# EasyEDA Pro project ArduinoIO_R1.eprj

# Schematic Schematic1
Create Date: 2022-08-13; Page Name: P1; Project Name: ArduinoIO_R1; Schematic Name: Schematic1; Update Date: 2022-08-13
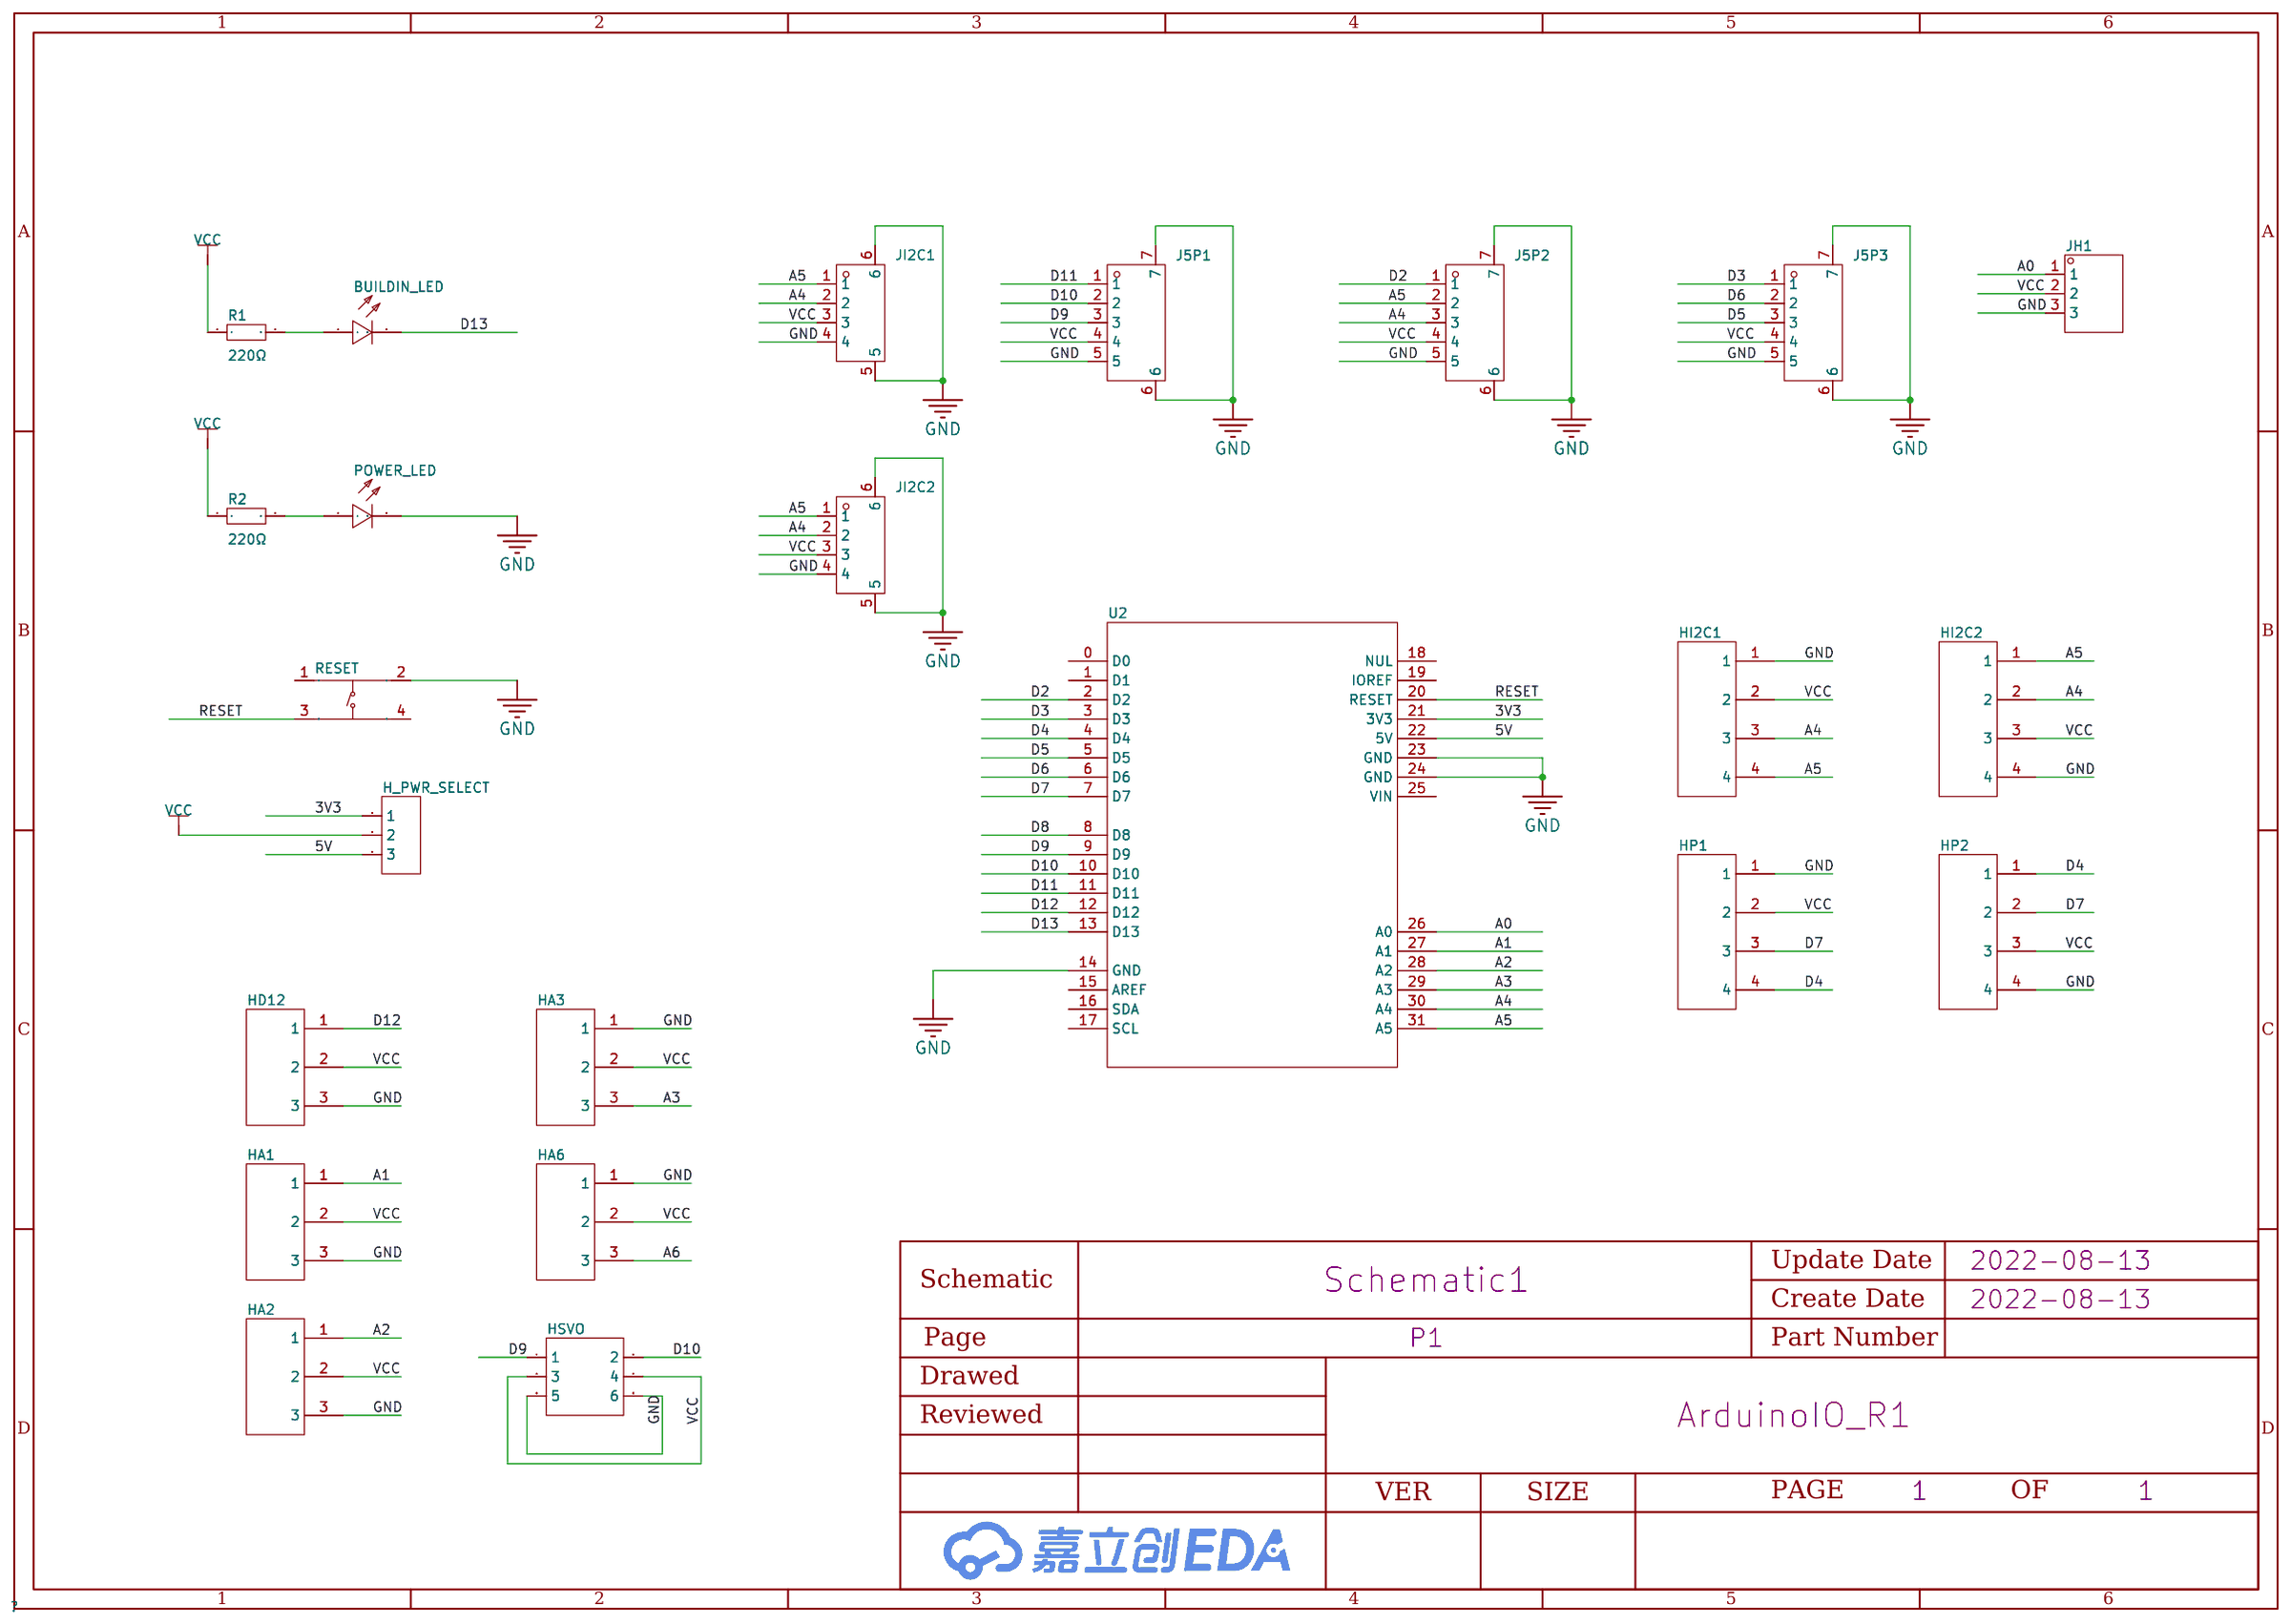
[diagram p0: schematic sheet]

## Parts
BUILDIN_LED  -  [LED0603-R-RD]
H_PWR_SELECT  -  [HDR-TH_3P-P2.54-V-M-1]
HA1  -  [CONN-TH_B3B-PH-K-S]
HA2  -  [CONN-TH_B3B-PH-K-S]
HA3  -  [CONN-TH_B3B-PH-K-S]
HA6  -  [CONN-TH_B3B-PH-K-S]
HD12  -  [CONN-TH_B3B-PH-K-S]
HI2C1  -  [CONN-TH_B4B-PH-K-S]
HI2C2  -  [CONN-TH_B4B-PH-K-S]
HP1  -  [CONN-TH_B4B-PH-K-S]
HP2  -  [CONN-TH_B4B-PH-K-S]
HSVO  -  [HDR-TH_6P-P2.54-V-M-R2-C3-S2.54-1]
J5P1  -  [FPC-SMD_5P-P2.00_DEALON_PH-5PWB]
J5P2  -  [FPC-SMD_5P-P2.00_DEALON_PH-5PWB]
J5P3  -  [FPC-SMD_5P-P2.00_DEALON_PH-5PWB]
JH1  -  [HDR-TH_3P-P2.54-V-M-1]
JI2C1  -  [CONN-SMD_4P-P2.00_HDGC_HDGC2001WR-S-4P]
JI2C2  -  [CONN-SMD_4P-P2.00_HDGC_HDGC2001WR-S-4P]
POWER_LED  -  [LED0603-R-RD]
R1  220Ω  [R0603]
R2  220Ω  [R0603]
RESET  -  [SW-TH_4P-L6.0-W6.0-P4.50-LS6.5]
U2  -  [ARDUINO_UNO_SHEILD]

## Library data of the parts
BUILDIN_LED POWER_LED = 19-217/GHC-YR1S2/3T: 照明颜色:翠绿;色温 - CCT（K）:-;主波长/色坐标:520~535nm;; LCSC Part Name: 翠绿LED; Supplier Part: C72043; Manufacturer: EVERLIGHT(台湾亿光); Supplier Footprint: 0603; JLCPCB Part Class: Basic Part; Datasheet: https://atta.szlcsc.com/upload/public/pdf/source/20160507/1462613613780.pdf; Supplier: LCSC; Mounting Type: 表面贴装; Illumination Color: 翠绿; Luminous Intensity (IF=20mA): 112~258mcd; Dominant Wavelength / Coordinate rank: 520~535nm
H_PWR_SELECT = 2.54-1*3P针: 间距:2.54mm;总PIN位数:3;排数:1;插针结构:1x3P;行距:-;安装类型:直插;圆针/方针:方针;额定电流:3A;额定电压:-;配合针长度:-;塑高:-;端接针长度:-;触头材质:-;触头镀层:-;工作温度范围:-40~+105;颜色:黑色;; LCSC Part Name: 2.54mm 1x3P 直插 方针; Supplier Part: C49257; Manufacturer: BOOMELE(博穆精密); Supplier Footprint: 插件,P=2.54mm; JLCPCB Part Class: Extended Part; Datasheet: https://atta.szlcsc.com/upload/public/pdf/source/20151109/1457707570948.pdf; Supplier: LCSC; Pitch: 2.54mm; Number of Pins: 3; Number of Rows: 1; Pin Structure: 1x3P; Mounting Type: 直插; Circluar Pins/Square Pins: 方针; Current Rating (Max): 3A; Operating Temperature Range: -40~+105; Color: 黑色
HA1-HA3 HA6 HD12 = B3B-PH-K-S(LF)(SN): 参考系列:PH;间距:2mm;插针结构:1x3P;排数:1;每排PIN数:3;行距:-;安装方式:-;触头材质:黄铜;; Supplier Part: C131339; Manufacturer: JST; Supplier Footprint: 插件,P=2mm; JLCPCB Part Class: Extended Part; Datasheet: https://atta.szlcsc.com/upload/public/pdf/source/20171026/C131339_15089839676151058812.pdf; Supplier: LCSC; Reference Series: PH; Pitch: 2mm; Pins Structure: 1x3P; Number of Rows: 1; Number of PINs Per Row: 3; Contact Material: 黄铜
HI2C1 HI2C2 HP1 HP2 = B4B-PH-K-S(LF)(SN): 参考系列:PH;间距:2mm;插针结构:1x4P;排数:1;每排PIN数:4;行距:-;安装方式:-;触头材质:黄铜;; Supplier Part: C131334; Manufacturer: JST; Supplier Footprint: 插件,P=2mm; JLCPCB Part Class: Extended Part; Datasheet: https://atta.szlcsc.com/upload/public/pdf/source/20171026/C131334_15089839666431058809.pdf; Supplier: LCSC; Reference Series: PH; Pitch: 2mm; Pins Structure: 1x4P; Number of Rows: 1; Number of PINs Per Row: 4; Contact Material: 黄铜
HSVO = 2.54-2*3P针: 间距:2.54mm;总PIN位数:6;排数:2;插针结构:-;行距:-;安装类型:直插;圆针/方针:-;额定电流:-;额定电压:-;配合针长度:-;塑高:-;触头材质:-;触头镀层:-;颜色:黑色;; LCSC Part Name: 2.54mm 直插; Supplier Part: C65114; Manufacturer: BOOMELE(博穆精密); Supplier Footprint: 直插,P=2.54mm; JLCPCB Part Class: Extended Part; Datasheet: https://atta.szlcsc.comnull; Supplier: LCSC; Pitch: 2.54mm; Number of Pins: 6; Number of Rows: 2; Mounting Type: 直插; Color: 黑色
J5P1-J5P3 = PH-5PWB: 参考系列:-;间距:2mm;插针结构:1x5P;排数:1;每排PIN数:5;行距:-;公母:公型插针;安装方式:卧贴;额定电流:2A;工作温度范围:-25~+85;; LCSC Part Name: 2mm 1x5P 卧贴; Supplier Part: C2905022; Manufacturer: DEALON(德艺隆); Supplier Footprint: SMD,P=2mm; JLCPCB Part Class: Extended Part; Datasheet: https://atta.szlcsc.com/upload/public/pdf/source/20211025/88D30C4184EDA7DDDA5DC9C9FBC20DFC.pdf; Supplier: LCSC; Pitch: 2mm; Pins Structure: 1x5P; Number of Rows: 1; Number of PINs Per Row: 5; Gender: 公型插针; Mounting Style: 卧贴; Current Rating (Max): 2A; Operating Temperature Range: -25~+85
JH1 = 77311-102-03LF: 间距:2.54mm;总PIN位数:-;排数:1;插针结构:-;行距:-;安装类型:直插;圆针/方针:方针;额定电流:-;额定电压:-;配合针长度:-;塑高:2.54mm;触头材质:磷青铜;触头镀层:-;颜色:黑色;; LCSC Part Name: 2.54mm 直插 方针; Supplier Part: C180248; Manufacturer: Amphenol; Supplier Footprint: 直插,P=2.54mm; JLCPCB Part Class: Extended Part; Datasheet: https://atta.szlcsc.com/upload/public/pdf/source/20180329/C180248_62E264527695F7ED58561BB828D45E42.pdf; Supplier: LCSC; Pitch: 2.54mm; Number of Rows: 1; Mounting Type: 直插; Circluar Pins/Square Pins: 方针; Insulation Height: 2.54mm; Contact Material: 磷青铜; Color: 黑色
JI2C1 JI2C2 = HDGC2001WR-S-4P: 参考系列:PH;间距:2mm;插针结构:1x4P;排数:1;每排PIN数:4;行距:-;公母:公型插针;安装方式:卧贴;额定电流:5A;工作温度范围:-25~+70;; LCSC Part Name: PH2.0针座卧贴 4P; Supplier Part: C2936226; Manufacturer: HDGC(华德共创); Supplier Footprint: SMD,P=2mm; JLCPCB Part Class: Extended Part; Datasheet: https://atta.szlcsc.com/upload/public/pdf/source/20211224/97C496F606ECD8881F21462B7EF9EC10.pdf; Supplier: LCSC; Reference Series: PH; Pitch: 2mm; Pins Structure: 1x4P; Number of Rows: 1; Number of PINs Per Row: 4; Gender: 公型插针; Mounting Style: 卧贴; Current Rating (Max): 5A; Operating Temperature Range: -25~+70
R1 R2 = TR0603B10K0P0525Z: 阻值:10kΩ;精度:±0.1%;温度系数:±25ppm/;功率:100mW;工作温度范围:-55~+155;电阻类型:薄膜电阻;最大工作电压:75V;; LCSC Part Name: 10kΩ ±0.1%; Supplier Part: C188363; Manufacturer: EVER OHMS(天二科技); Supplier Footprint: 0603; JLCPCB Part Class: Extended Part; Datasheet: https://atta.szlcsc.com/upload/public/pdf/source/20190415/C188363_433BF05B6FB8F7A0F5F35A3E4390C55A.pdf; Supplier: LCSC; Tolerance: ±0.1%; Temperature Coefficient: ±25ppm/; Power(Watts): 100mW; Operating Temperature Range: -55~+155; Type: 薄膜电阻; Overload Voltage (Max): 75V
RESET = TS665CJ: 触点电流:50mA;额定电压(DC):12V;电路结构:单刀单掷;安装方式:直插;按钮形状:圆形按钮;带灯:-;开关长度:6mm;开关宽度:6mm;开关高度:5mm;; LCSC Part Name: 6*6*5插件立式直插6x6dip按键轻触开关; Supplier Part: C393938; Manufacturer: SHOU HAN(首韩); Supplier Footprint: 插件; JLCPCB Part Class: Extended Part; Datasheet: https://atta.szlcsc.com/upload/public/pdf/source/20190521/C393938_BDABEAC600B4C55E200A80AA129B70BC.pdf; Supplier: LCSC; Contact Current: 50mA; Voltage Rating (DC): 12V; Circuit: 单刀单掷; Mounting Style: 直插; Actuator Style: 圆形按钮; Switch Length: 6mm; Switch Width: 6mm; Switch Height: 5mm
U2 = arduino_uno

## Nets
3V3: H_PWR_SELECT.1 U2.21(3V3)
5V: H_PWR_SELECT.3 U2.22(5V)
GND: HA1.3 HA2.3 HA3.1 HA6.1 HD12.3 HI2C1.1 HI2C2.4 HP1.1 HP2.4 HSVO.5 HSVO.6 J5P1.5 J5P1.6 J5P1.7 J5P2.5 J5P2.6 J5P2.7 J5P3.5 J5P3.6 J5P3.7 JH1.3 JI2C1.4 JI2C1.5 JI2C1.6 JI2C2.4 JI2C2.5 JI2C2.6 POWER_LED.2(C) RESET.2(B) U2.14(GND) U2.23(GND) U2.24(GND)
VCC: H_PWR_SELECT.2 HA1.2 HA2.2 HA3.2 HA6.2 HD12.2 HI2C1.2 HI2C2.3 HP1.2 HP2.3 HSVO.3 HSVO.4 J5P1.4 J5P2.4 J5P3.4 JH1.2 JI2C1.3 JI2C2.3 R1.1 R2.1
A0: JH1.1 U2.26(A0)
A1: HA1.1 U2.27(A1)
A2: HA2.1 U2.28(A2)
A3: HA3.3 U2.29(A3)
A4: HI2C1.3 HI2C2.2 J5P2.3 JI2C1.2 JI2C2.2 U2.30(A4)
A5: HI2C1.4 HI2C2.1 J5P2.2 JI2C1.1 JI2C2.1 U2.31(A5)
A6: HA6.3
D2: J5P2.1 U2.2(D2)
D3: J5P3.1 U2.3(D3)
D4: HP1.4 HP2.1 U2.4(D4)
D5: J5P3.3 U2.5(D5)
D6: J5P3.2 U2.6(D6)
D7: HP1.3 HP2.2 U2.7(D7)
D8: U2.8(D8)
D9: HSVO.1 J5P1.3 U2.9(D9)
D10: HSVO.2 J5P1.2 U2.10(D10)
D11: J5P1.1 U2.11(D11)
D12: HD12.1 U2.12(D12)
D13: BUILDIN_LED.2(C) U2.13(D13)
RESET: RESET.3(C) U2.20(RESET)
$1N1147: BUILDIN_LED.1(A) R1.2
$1N1725: POWER_LED.1(A) R2.2

Not connected (* = marked no-connect by the designer): RESET 1(A) 4(D); U2 0(D0) 1(D1) 15(AREF) 16(SDA) 17(SCL) 18(NUL) 19(IOREF) 25(VIN)

# Board PCB1
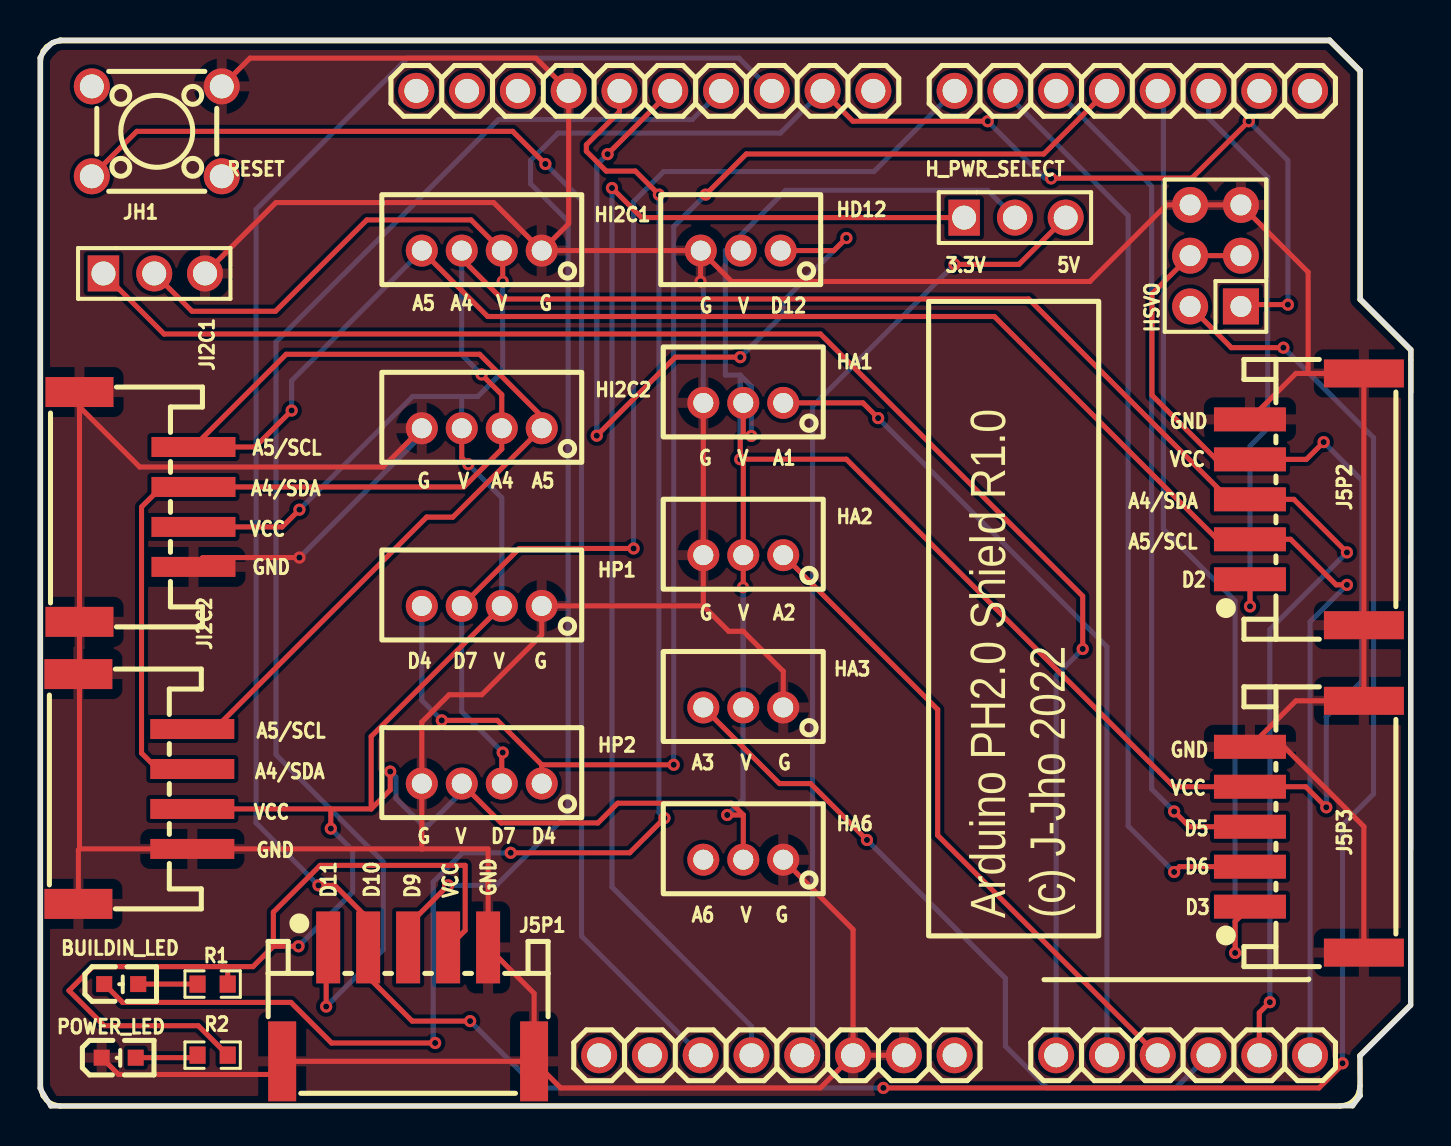
[diagram p1: board, top side]
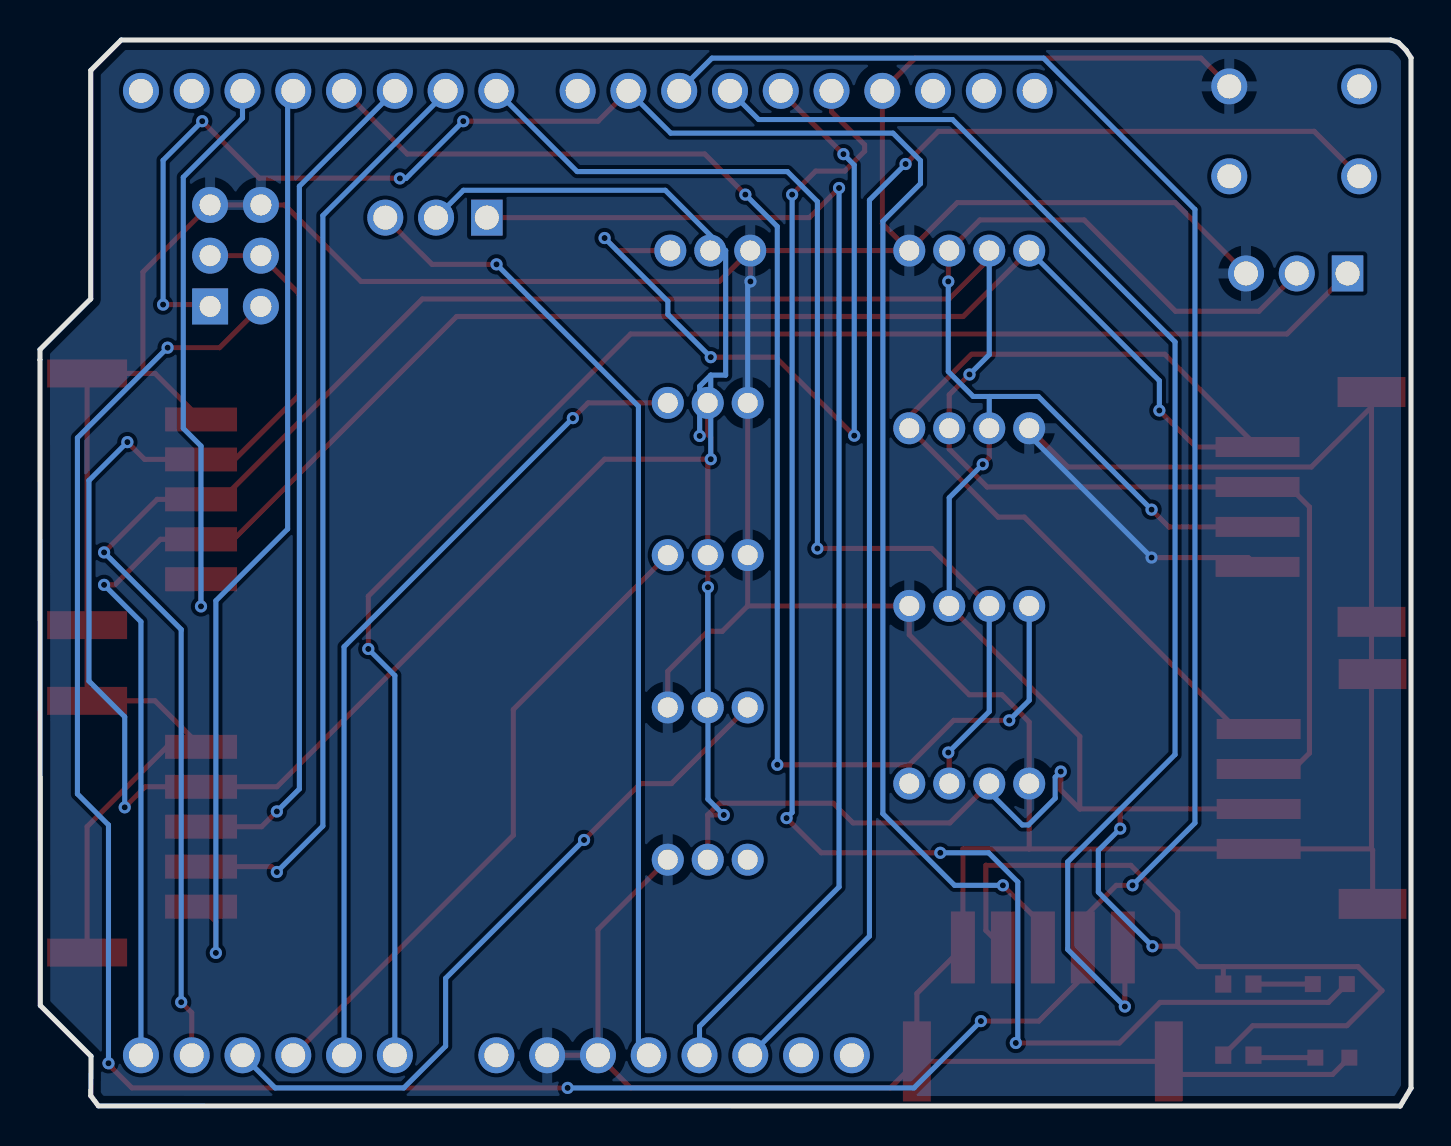
[diagram p2: board, bottom side, seen from below]

Outline 68.58 x 53.35 mm; copper layers: Top Layer, Bottom Layer. Coordinates in mm from the lower left corner of the outline.
Outline path: 0,52.46 0.25,52.84 0.64,53.22 1.02,53.35 64.52,53.35 66.04,51.82 66.04,40.39 68.58,37.85 68.58,37.34 68.56,5.03 66.03,2.49 66.04,0.51 65.66,0.01 0.54,0 0,0.9 0,52.46
Stack: Top Layer 0.035mm / Dielectric1 1.51mm FR4 er 4.5 / Bottom Layer 0.035mm

## Design rules (mm)
spacing safeClearance (default): track to track 0.152, other pairs 0.152 to 0.3
track width trackWidth (default): min 0.127, default 0.254, max 2.54
differential pair differentialPair (default): width min 0.127, default 0.254, max 2.54; gap min 0.152, default 0.152
via viaSize (default): diameter min 0.5, default 0.61, max 10; hole min 0.3, default 0.305, max 6

## Placement (name value [footprint] x y rotation side)
BUILDIN_LED  -  [LED0603-R-RD]  4.06 6.1 0 top
H_PWR_SELECT  -  [HDR-TH_3P-P2.54-V-M-1]  48.77 44.46 0 top
HA1  -  [CONN-TH_B3B-PH-K-S]  35.18 35.19 0 top
HA2  -  [CONN-TH_B3B-PH-K-S]  35.18 27.57 0 top
HA3  -  [CONN-TH_B3B-PH-K-S]  35.18 19.95 0 top
HA6  -  [CONN-TH_B3B-PH-K-S]  35.18 12.33 0 top
HD12  -  [CONN-TH_B3B-PH-K-S]  35.05 42.81 0 top
HI2C1  -  [CONN-TH_B4B-PH-K-S]  22.1 42.81 0 top
HI2C2  -  [CONN-TH_B4B-PH-K-S]  22.1 33.92 0 top
HP1  -  [CONN-TH_B4B-PH-K-S]  22.1 25.03 0 top
HP2  -  [CONN-TH_B4B-PH-K-S]  22.1 16.14 0 top
HSVO  -  [HDR-TH_6P-P2.54-V-M-R2-C3-S2.54-1]  58.8 42.55 90 top
J5P1  -  [FPC-SMD_5P-P2.00_DEALON_PH-5PWB]  18.41 5.09 0 top
J5P2  -  [FPC-SMD_5P-P2.00_DEALON_PH-5PWB]  63.37 30.36 90 top
J5P3  -  [FPC-SMD_5P-P2.00_DEALON_PH-5PWB]  63.37 13.98 90 top
JH1  -  [HDR-TH_3P-P2.54-V-M-1]  5.72 41.66 0 top
JI2C1  -  [CONN-SMD_4P-P2.00_HDGC_HDGC2001WR-S-4P]  4.83 29.98 270 top
JI2C2  -  [CONN-SMD_4P-P2.00_HDGC_HDGC2001WR-S-4P]  4.77 15.87 270 top
POWER_LED  -  [LED0603-R-RD]  3.94 2.42 0 top
R1  220Ω  [R0603]  8.64 6.1 180 top
R2  220Ω  [R0603]  8.64 2.55 180 top
RESET  -  [SW-TH_4P-L6.0-W6.0-P4.50-LS6.5]  5.84 48.77 0 top
U2  -  [ARDUINO_UNO_SHEILD]  0.03 0 0 top

## Footprints (pads in the part's own frame, mm; a bottom-side part is the same pattern mirrored in y, then rotated)
ARDUINO_UNO_SHEILD
  round 1.8 hole 1.2: 0(63.5,50.8) 1(60.96,50.8) 2(58.42,50.8) 3(55.88,50.8) 4(53.34,50.8) 5(50.8,50.8) 6(48.26,50.8) 7(45.72,50.8) 8(41.656,50.8) 9(39.116,50.8) 10(36.576,50.8) 11(34.036,50.8) 12(31.496,50.8) 13(28.956,50.8) 14(26.416,50.8) 15(23.876,50.8) 16(21.336,50.8) 17(18.796,50.8) 18(27.94,2.54) 19(30.48,2.54) 20(33.02,2.54) 21(35.56,2.54) 22(38.1,2.54) 23(40.64,2.54) 24(43.18,2.54) 25(45.72,2.54) 26(50.8,2.54) 27(53.34,2.54) 28(55.88,2.54) 29(58.42,2.54) 30(60.96,2.54) 31(63.5,2.54)
CONN-SMD_4P-P2.00_HDGC_HDGC2001WR-S-4P
  rect 1x4.2 smd: 1(-3,2.85) 2(-1,2.85) 3(1,2.85) 4(3,2.85)
  rect 1.5x3.4 smd: 5(5.75,-2.85) 6(-5.75,-2.85)
CONN-TH_B3B-PH-K-S
  round 1.6 hole 1.001: 1(1.999,0) 2(0,0) 3(-1.999,0)
CONN-TH_B4B-PH-K-S
  round 1.6 hole 1.001: 1(2.999,0) 2(1.001,0) 3(-1.001,0) 4(-2.999,0)
FPC-SMD_5P-P2.00_DEALON_PH-5PWB
  rect 1.2x3.6 smd: 1(-4,2.85) 2(-2,2.85) 3(0,2.85) 4(2,2.85) 5(4,2.85)
  rect 1.4x4 smd: 6(6.3,-2.85) 7(-6.3,-2.85)
HDR-TH_3P-P2.54-V-M-1
  rect 1.575x1.801 hole 1.199: 1(-2.54,0)
  round 1.801 hole 1.199: 2(0,0) 3(2.54,0)
HDR-TH_6P-P2.54-V-M-R2-C3-S2.54-1
  rect 1.801x1.801 hole 1.049: 1(-2.54,-1.27)
  round 1.801 hole 1.049: 2(-2.54,1.27) 3(0,-1.27) 4(0,1.27) 5(2.54,-1.27) 6(2.54,1.27)
LED0603-R-RD
  rect 0.8x0.8 smd: 1(0.851,0) 2(-0.851,0)
R0603
  rect 0.806x0.864 smd: 1(-0.753,0) 2(0.753,0)
SW-TH_4P-L6.0-W6.0-P4.50-LS6.5
  round 1.8 hole 1.2: 1(-3.25,2.25) 2(3.25,2.25) 3(-3.25,-2.25) 4(3.25,-2.25)

## Nets
As in the schematic.

Pads without a net: RESET 1 4; U2 0 1 15 16 17 18 19 25

## Via types
v1: diameter 0.61, hole 0.305, Top Layer to Bottom Layer, 53 vias

## Routing (per net, layer and track width the routed paths; a pad name or vN(x,y) marks a point on that pad's centre or on a via; arc(x,y) is an arc through that point)
3V3: length 64.5
  Top Layer w0.254: v1(28.61,45.94) 30.09,44.46 H_PWR_SELECT.1
  Bottom Layer w0.254: 35.59,2.54 35.59,3.98 28.61,10.96 v1(28.61,45.94)
5V: length 49.3
  Top Layer w0.254: H_PWR_SELECT.3 48.97,42.12 v1(45.74,42.12)
  Bottom Layer w0.254: v1(45.74,42.12) 38.65,35.02 38.65,3.05 38.13,2.54
GND: length 330.1
  Top Layer w0.254: 63.43,36.66 62.82,36.66 J5P2.5 ; 63.43,36.66 J5P2.6 J5P3.6 62.82,20.28 J5P3.5 62.23,17.98 66.22,13.98 J5P3.7 ; 63.43,36.66 63.43,41.73 60.07,45.09 HSVO.6 56.35,45.09 52.52,41.26 34.6,41.26 HD12.3 33.04,42.81 ; 40.67,2.54 40.67,8.83 HA6.1 ; 40.67,2.54 43.21,2.54 ; 40.67,2.54 39.04,0.91 26.05,0.91 J5P1.6 ; 1.98,21.62 JI2C1.5 1.98,34.99 ; 1.98,21.62 JI2C2.6 ; 1.98,21.62 1.98,12.87 ; 19.1,12.87 HP2.4 19.1,19.21 20.46,20.58 22.1,20.58 25.1,23.58 HP1.1 33.18,25.03 ; 19.1,12.87 JI2C2.4 1.98,12.87 ; 19.1,12.87 22.41,12.87 J5P1.5 24.72,5.64 J5P1.6 ; v1(33.04,41.26) 33.04,42.81 ; 33.04,42.81 HI2C1.1 ; HI2C1.1 22.7,45.21 11.8,45.21 JH1.3 ; HI2C1.1 26.45,44.15 U2.14 24.81,52.44 10.51,52.44 RESET.2 ; 1.98,12.87 1.92,12.81 JI2C2.5 ; J5P1.6 J5P1.7 11.46,1.58 3.93,1.58 POWER_LED.2 ; 1.98,34.99 4.98,31.98 17.16,31.98 HI2C2.4 ; 1.98,34.99 JI2C1.6 ; HA1.3 HA2.3 33.18,25.03 ; v1(12.98,27.45) 8.14,27.45 JI2C1.4 ; 33.18,25.03 34.45,23.76 35.18,23.76 37.18,21.76 HA3.1
  Bottom Layer w0.254: v1(12.98,27.45) 19.1,33.57 HI2C2.4 ; v1(33.04,41.26) 33.18,41.12 HA1.3
VCC: length 289.1
  Top Layer w0.254: 35.18,14.56 34.59,15.15 28.9,15.15 27.91,14.17 23.07,14.17 HP2.3 ; 35.18,14.56 HA6.2 ; 35.18,14.56 v1(34.38,14.56) ; 9.39,6.98 10.65,6.98 11.67,7.99 ; 9.39,6.98 R1.1 ; 9.39,6.98 2.65,6.98 1.45,5.78 3.21,4.02 7.92,4.02 R2.1 ; v1(17.52,16.74) 17.52,15.82 16.57,14.87 ; 35.18,32.37 v1(35.03,32.37) 35.03,33.46 35.18,33.61 HA1.2 ; 35.18,32.37 HA2.2 35.18,25.97 v1(35.17,25.96) ; 35.18,32.37 40.34,32.37 56.73,15.98 J5P3.4 63.31,15.98 v1(64.34,14.95) ; v1(21.42,32.11) 21.1,32.44 HI2C2.3 ; 16.57,14.87 16.57,18.49 23.1,25.03 ; 16.57,14.87 14.55,14.87 ; 11.67,7.99 v1(12.93,7.99) ; 11.67,7.99 11.67,9.7 14.02,12.04 21.27,12.04 21.27,8.79 J5P1.4 ; v1(14.55,13.88) 14.55,14.87 ; 14.55,14.87 JI2C2.3 ; v1(12.98,29.84) 12.11,28.98 JI2C1.3 ; JH1.2 7.61,39.77 11.78,39.77 16.35,44.34 21.56,44.34 23.15,42.76 v1(23.15,41.26) ; 60.07,42.55 HSVO.4 55.62,40.65 55.62,35.57 58.83,32.36 63.35,32.36 v1(64.21,33.22)
  Bottom Layer w0.254: HD12.2 34.28,42.81 ; 34.28,42.81 37.3,45.82 47.4,45.82 H_PWR_SELECT.2 ; 34.28,42.81 34.28,36.57 35.03,36.57 ; v1(12.98,29.84) 18.64,35.51 21.1,35.51 ; 35.03,36.57 v1(35.03,32.37) ; 35.03,36.57 35.58,36.02 v1(35.58,33.53) ; v1(23.15,41.26) 23.15,36.75 21.9,35.51 21.1,35.51 ; 21.1,35.51 HI2C2.3 ; v1(14.55,13.88) 15.64,12.79 15.64,10.7 v1(12.93,7.99) ; HA3.2 35.18,25.95 v1(35.17,25.96) 35.17,15.36 v1(34.38,14.56) ; v1(64.34,14.95) 64.34,19.48 66.13,21.27 66.13,31.3 v1(64.21,33.22) ; HP2.3 21.1,15.71 19.45,14.07 19.14,14.07 17.8,15.4 17.8,16.46 v1(17.52,16.74) ; v1(21.42,32.11) 23.1,30.44 23.1,25.03
A0: length 79.2
  Top Layer w0.254: JH1.1 6.21,38.63 39.04,38.63 52.16,25.51 v1(52.16,22.87)
  Bottom Layer w0.254: v1(52.16,22.87) 50.83,21.54 50.83,2.54
A1: length 41.7
  Top Layer w0.254: v1(41.93,34.42) 41.16,35.19 HA1.1
  Bottom Layer w0.254: v1(41.93,34.42) 53.37,22.98 53.37,2.54
A2: length 32.8
  Top Layer w0.254: HA2.1 44.9,19.84 44.9,13.55 55.91,2.54
A3: length 35.8
  Top Layer w0.254: HA3.3 36.99,16.14 38.54,16.14 v1(41.37,13.31)
  Bottom Layer w0.254: 58.45,2.54 56.82,0.91 50.38,0.91 48.29,3 48.29,6.39 v1(41.37,13.31)
A4: length 122.9
  Top Layer w0.254: v1(65.37,27.7) 62.72,30.36 J5P2.3 59.48,30.36 49.46,40.39 23.11,40.39 21.1,42.4 HI2C1.3 ; 60.99,2.54 60.99,4.67 v1(61.52,5.2) ; JI2C2.2 5.87,16.87 5.08,17.66 5.08,29.98 6.08,30.98 21.2,30.98 23.1,32.87 23.1,35.6 v1(22.09,36.61)
  Bottom Layer w0.254: v1(22.09,36.61) 21.1,37.6 HI2C1.3 ; v1(61.52,5.2) 61.52,23.85 v1(65.37,27.7)
A5: length 138.8
  Top Layer w0.254: JI2C2.1 8.73,18.87 19.34,29.47 20.65,29.47 HI2C2.1 25.1,34.51 21.99,37.62 12.32,37.62 JI2C1.1 10.76,32.98 v1(12.59,34.81) ; HI2C1.4 22.4,39.51 47.74,39.51 58.89,28.36 J5P2.2 62.56,28.36 64.84,26.08 v1(65.37,26.08)
  Bottom Layer w0.254: v1(12.59,34.81) 12.59,36.3 HI2C1.4 ; v1(65.37,26.08) 63.53,24.23 63.53,2.54
D2: length 28.8
  Top Layer w0.254: v1(60.53,25) 60.53,26.36 J5P2.1
  Bottom Layer w0.254: U2.2 58.45,49.44 61.41,46.48 61.41,33.91 60.53,33.03 v1(60.53,25)
D3: length 47.4
  Top Layer w0.254: J5P3.1 59.78,9.24 v1(59.78,7.66)
  Bottom Layer w0.254: v1(59.78,7.66) 59.78,25.28 56.19,28.87 56.19,50.52 U2.3
D4: length 71
  Top Layer w0.254: 25.1,17.08 HP2.1 ; 25.1,17.08 22.88,19.3 v1(20.1,19.3) ; 25.1,17.08 v1(31.7,17.08) ; v1(33.3,45.61) 35.33,47.64 50.21,47.64 U2.4
  Bottom Layer w0.254: v1(31.7,17.08) 31.7,44.01 v1(33.3,45.61) ; HP1.4 19.1,20.3 v1(20.1,19.3)
D5: length 42.6
  Top Layer w0.254: v1(56.73,14.74) 57.5,13.98 J5P3.3
  Bottom Layer w0.254: U2.5 55.61,46.02 55.61,15.87 v1(56.73,14.74)
D6: length 46.5
  Top Layer w0.254: J5P3.2 57,11.98 v1(56.73,11.71)
  Bottom Layer w0.254: U2.6 48.29,50.7 54.43,44.56 54.43,14.01 v1(56.73,11.71)
D7: length 55.3
  Top Layer w0.254: v1(29.69,27.9) 23.97,27.9 HP1.3 ; v1(23.15,17.69) 23.1,17.64 23.1,16.14
  Bottom Layer w0.254: v1(29.69,27.9) 29.69,45.26 31.19,46.76 41.71,46.76 U2.7 ; v1(23.15,17.69) 21.1,19.74 HP1.3
D9: length 97.6
  Top Layer w0.254: v1(47.41,49.28) 40.66,49.28 U2.9 ; v1(20.41,11.04) 18.41,9.04 J5P1.3 ; v1(60.47,49.28) 57.62,46.43 50.59,46.43 v1(50.58,46.42) ; 60.07,40.01 60.16,40.1 v1(62.42,40.1)
  Bottom Layer w0.254: v1(20.41,11.04) 22.83,11.04 26.42,14.63 26.42,44.28 24.54,46.16 24.54,47.31 25.91,48.68 37.03,48.68 U2.9 ; v1(60.47,49.28) 62.42,47.32 v1(62.42,40.1) ; v1(47.41,49.28) 50.27,46.42 v1(50.58,46.42)
D10: length 166.2
  Top Layer w0.254: v1(65.15,2.14) 64.97,1.96 64.97,1.9 63.98,0.91 v1(42.19,0.91) ; v1(62.2,37.95) 59.59,37.95 HSVO.2 ; v1(21.52,4.25) 18.62,4.25 16.42,6.45 16.42,9.37 14.74,11.04 v1(13.93,11.04)
  Bottom Layer w0.254: v1(13.93,11.04) 10.81,14.17 10.81,44.86 18.38,52.44 34.97,52.44 U2.10 ; v1(65.15,2.14) 65.15,14.07 66.71,15.62 66.71,33.44 v1(62.2,37.95) ; v1(42.19,0.91) 24.86,0.91 v1(21.52,4.25)
D11: length 67.1
  Top Layer w0.254: v1(14.31,4.98) 14.31,7.84 J5P1.1
  Bottom Layer w0.254: U2.11 32.63,49.37 22.94,49.37 11.8,38.24 11.8,17.59 17.17,12.22 17.17,7.84 v1(14.31,4.98)
D12: length 39.3
  Top Layer w0.254: v1(35.03,37.47) 31.78,37.47 v1(27.85,33.55) ; v1(28.39,47.63) 31.53,50.77 U2.12 ; v1(40.34,43.44) 39.71,42.81 HD12.1
  Bottom Layer w0.254: v1(35.03,37.47) 37.17,39.62 37.17,40.27 v1(40.34,43.44) ; v1(27.85,33.55) 27.85,47.09 v1(28.39,47.63)
D13: length 78.3
  Top Layer w0.254: v1(23.55,12.67) 29.5,12.67 v1(31.24,14.41) ; BUILDIN_LED.2 4.13,5.19 12.55,5.19 14.59,3.15 v1(19.77,3.15) ; U2.13 28.99,49.76 27.33,48.1 27.33,47.78 28.32,46.79 29.78,46.79 v1(30.96,45.61)
  Bottom Layer w0.254: v1(19.77,3.15) 19.67,3.25 19.67,11.21 21.13,12.67 v1(23.55,12.67) ; v1(30.96,45.61) 30.96,14.69 v1(31.24,14.41)
RESET: length 72.1
  Top Layer w0.254: v1(25.28,47.14) 23.65,48.77 4.84,48.77 RESET.3
  Bottom Layer w0.254: v1(25.28,47.14) 27.09,45.33 27.09,8.5 33.05,2.54
$1N1147: length 3
  Top Layer w0.254: R1.2 BUILDIN_LED.1
$1N1725: length 3.1
  Top Layer w0.254: POWER_LED.1 7.76,2.42 R2.2

## Copper pours and planes (outline as drawn; the poured copper is in the pictures)
GND on Top Layer: -24.64,59.95 96.39,59.95 96.39,-5.58 -24.64,-5.58
GND on Bottom Layer: -3.81,77.35 75.31,77.35 75.31,-23.49 -3.81,-23.49

## Text on the board
Top Silkscreen Layer: VCC | A4/SDA | A5/SCL | GND | D4 | A5 | G | A4 | D7 | V | A3 | A6 | D12 | A1 | A2 | 3.3V | 5V | D2 | D5 | D6 | D3 | D11 | D10 | D9 | Arduino PH2.0 Shield R1.0 / (c) J-Jho 2022
